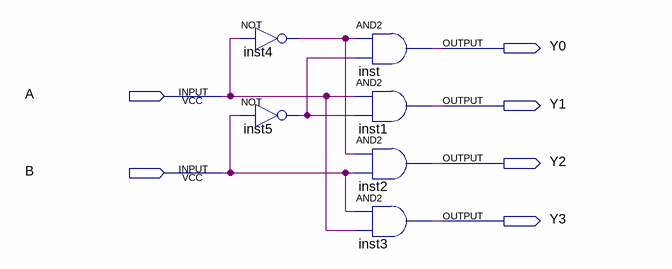
[diagram p0: schematic sheet]
// Quartus schematic 2x4_decoder.bdf as structural Verilog: 6 symbols, 6 pins
module \2x4_decoder  (
  input  A,
  input  B,
  output Y0,
  output Y1,
  output Y2,
  output Y3
);

  wire inst4_out, inst5_out;

  not inst4 (inst4_out, A);
  not inst5 (inst5_out, B);
  and inst (Y0, inst4_out, inst5_out);
  and inst1 (Y1, A, inst5_out);
  and inst2 (Y2, inst4_out, B);
  and inst3 (Y3, B, A);
endmodule
